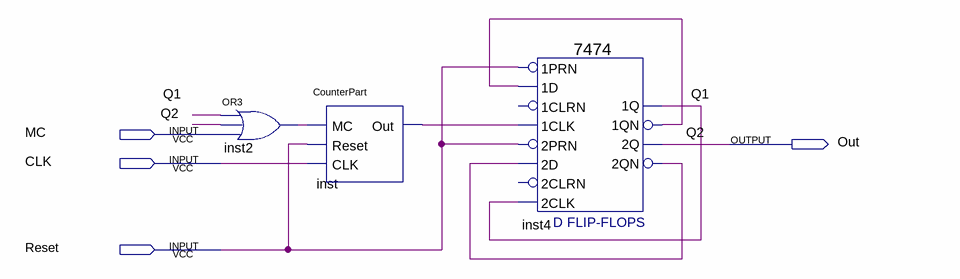
[diagram p0: schematic sheet]
// Quartus schematic Counter8_9.bdf as structural Verilog: 3 symbols, 4 pins
module Counter8_9 (
  input  MC,
  input  CLK,
  input  Reset,
  output Out
);

  wire inst2_out, inst4_1qn, inst4_2qn, inst_out, Q1;

  or inst2 (inst2_out, Q1, Out, MC);
  CounterPart inst (.MC(inst2_out), .Reset(Reset), .CLK(CLK), .Out(inst_out));
  \7474  inst4 (
    .\2D (inst4_2qn), .\2PRN (Reset), .\1CLK (inst_out), .\1D (inst4_1qn), .\1PRN (Reset), .\2CLK (Q1),
    .\1QN (inst4_1qn), .\2Q (Out), .\2QN (inst4_2qn), .\1Q (Q1));  // open: 2CLRN, 1CLRN

  // Other names for the same wires on the sheet: Q2 = Out
endmodule
